# Altium schematic sheet BMS AFE - Top Sheet.SchDoc: Title
size B; Organization: Midnight Sun Solar Rayce Car Team; Address1: University of Waterloo; Address2: 200 University Ave W; Address3: Waterloo, ON, Canada; Address4: N2L 3E9; DocumentNumber: 1; SheetNumber: 1; SheetTotal: 7; Website: www.uwmidsun.com; ProjectName: ProjectName
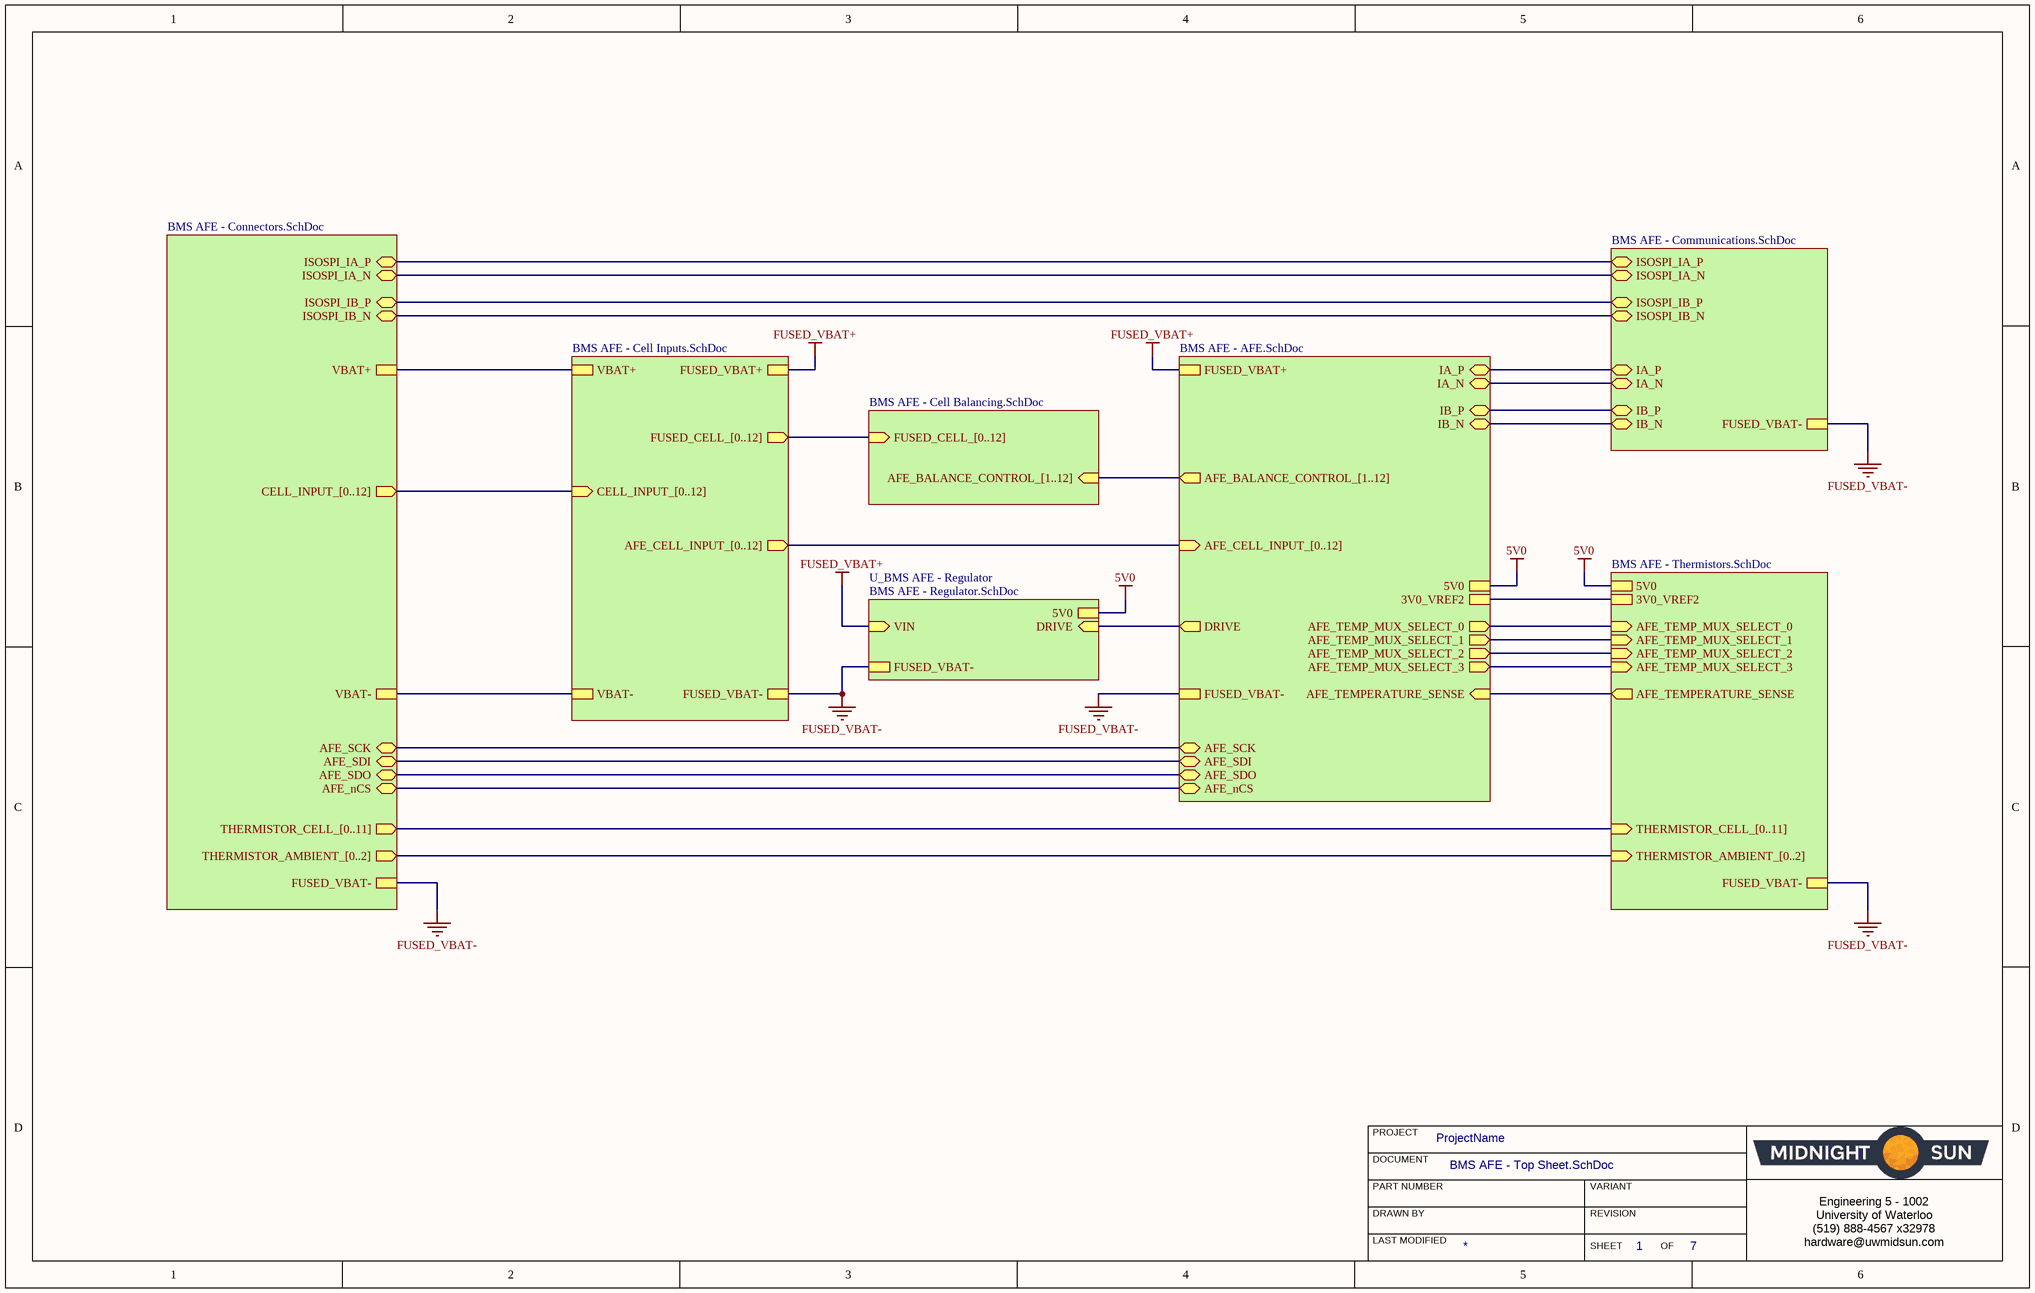
[diagram p0: BMS AFE - Top Sheet.SchDoc]

## Sub-sheets
BMS AFE - AFE = BMS AFE - AFE.SchDoc: AFE_BALANCE_CONTROL_[1..12] (out), AFE_TEMP_MUX_SELECT_0 (out), AFE_TEMP_MUX_SELECT_3 (out), AFE_nCS (bidir), AFE_SCK (bidir), AFE_TEMP_MUX_SELECT_2 (out), 5V0, FUSED_VBAT-, 3V0_VREF2, AFE_CELL_INPUT_[0..12] (in), AFE_TEMPERATURE_SENSE (in), AFE_TEMP_MUX_SELECT_1 (out), FUSED_VBAT+, AFE_SDI (bidir), AFE_SDO (bidir), IA_N (bidir), IA_P (bidir), IB_N (bidir), IB_P (bidir), DRIVE (out)
BMS AFE - Cell Balancing = BMS AFE - Cell Balancing.SchDoc: FUSED_CELL_[0..12] (in), AFE_BALANCE_CONTROL_[1..12] (in)
BMS AFE - Cell Inputs = BMS AFE - Cell Inputs.SchDoc: VBAT+, FUSED_VBAT+, CELL_INPUT_[0..12] (in), AFE_CELL_INPUT_[0..12] (out), FUSED_VBAT-, FUSED_CELL_[0..12] (out), VBAT-
BMS AFE - Communications = BMS AFE - Communications.SchDoc: IB_P (bidir), IB_N (bidir), ISOSPI_IA_P (bidir), ISOSPI_IA_N (bidir), IA_P (bidir), ISOSPI_IB_P (bidir), IA_N (bidir), ISOSPI_IB_N (bidir), FUSED_VBAT-
BMS AFE - Connectors = BMS AFE - Connectors.SchDoc: ISOSPI_IB_N (bidir), ISOSPI_IB_P (bidir), ISOSPI_IA_N (bidir), ISOSPI_IA_P (bidir), VBAT+, VBAT-, AFE_nCS (bidir), AFE_SCK (bidir), CELL_INPUT_[0..12] (out), THERMISTOR_CELL_[0..11] (out), AFE_SDI (bidir), AFE_SDO (bidir), FUSED_VBAT-, THERMISTOR_AMBIENT_[0..2] (out)
BMS AFE - Thermistors = BMS AFE - Thermistors.SchDoc: AFE_TEMPERATURE_SENSE (out), THERMISTOR_AMBIENT_[0..2] (in), 5V0, 3V0_VREF2, AFE_TEMP_MUX_SELECT_3 (in), AFE_TEMP_MUX_SELECT_2 (in), AFE_TEMP_MUX_SELECT_1 (in), AFE_TEMP_MUX_SELECT_0 (in), THERMISTOR_CELL_[0..11] (in), FUSED_VBAT-
U_BMS AFE - Regulator = BMS AFE - Regulator.SchDoc: DRIVE (in), VIN (in), 5V0, FUSED_VBAT-

## Nets
5V0: sheet BMS AFE - AFE/5V0, sheet BMS AFE - Thermistors/5V0, sheet U_BMS AFE - Regulator/5V0
FUSED_VBAT+: sheet BMS AFE - AFE/FUSED_VBAT+, sheet BMS AFE - Cell Inputs/FUSED_VBAT+, sheet U_BMS AFE - Regulator/VIN
FUSED_VBAT-: sheet BMS AFE - AFE/FUSED_VBAT-, sheet BMS AFE - Cell Inputs/FUSED_VBAT-, sheet BMS AFE - Communications/FUSED_VBAT-, sheet BMS AFE - Thermistors/FUSED_VBAT-, sheet BMS AFE - Connectors/FUSED_VBAT-, sheet U_BMS AFE - Regulator/FUSED_VBAT-
(unnamed): sheet BMS AFE - AFE/AFE_TEMP_MUX_SELECT_0, sheet BMS AFE - Thermistors/AFE_TEMP_MUX_SELECT_0
(unnamed): sheet BMS AFE - AFE/AFE_TEMP_MUX_SELECT_3, sheet BMS AFE - Thermistors/AFE_TEMP_MUX_SELECT_3
(unnamed): sheet BMS AFE - AFE/AFE_nCS, sheet BMS AFE - Connectors/AFE_nCS
(unnamed): sheet BMS AFE - AFE/AFE_SCK, sheet BMS AFE - Connectors/AFE_SCK
(unnamed): sheet BMS AFE - AFE/AFE_TEMP_MUX_SELECT_2, sheet BMS AFE - Thermistors/AFE_TEMP_MUX_SELECT_2
(unnamed): sheet BMS AFE - AFE/3V0_VREF2, sheet BMS AFE - Thermistors/3V0_VREF2
(unnamed): sheet BMS AFE - AFE/AFE_TEMPERATURE_SENSE, sheet BMS AFE - Thermistors/AFE_TEMPERATURE_SENSE
(unnamed): sheet BMS AFE - AFE/AFE_TEMP_MUX_SELECT_1, sheet BMS AFE - Thermistors/AFE_TEMP_MUX_SELECT_1
(unnamed): sheet BMS AFE - AFE/AFE_SDI, sheet BMS AFE - Connectors/AFE_SDI
(unnamed): sheet BMS AFE - AFE/AFE_SDO, sheet BMS AFE - Connectors/AFE_SDO
(unnamed): sheet BMS AFE - AFE/IA_N, sheet BMS AFE - Communications/IA_N
(unnamed): sheet BMS AFE - AFE/IA_P, sheet BMS AFE - Communications/IA_P
(unnamed): sheet BMS AFE - AFE/IB_N, sheet BMS AFE - Communications/IB_N
(unnamed): sheet BMS AFE - AFE/IB_P, sheet BMS AFE - Communications/IB_P
(unnamed): sheet BMS AFE - AFE/DRIVE, sheet U_BMS AFE - Regulator/DRIVE
(unnamed): sheet BMS AFE - Cell Inputs/VBAT+, sheet BMS AFE - Connectors/VBAT+
(unnamed): sheet BMS AFE - Cell Inputs/VBAT-, sheet BMS AFE - Connectors/VBAT-
(unnamed): sheet BMS AFE - Communications/ISOSPI_IA_P, sheet BMS AFE - Connectors/ISOSPI_IA_P
(unnamed): sheet BMS AFE - Communications/ISOSPI_IA_N, sheet BMS AFE - Connectors/ISOSPI_IA_N
(unnamed): sheet BMS AFE - Communications/ISOSPI_IB_P, sheet BMS AFE - Connectors/ISOSPI_IB_P
(unnamed): sheet BMS AFE - Communications/ISOSPI_IB_N, sheet BMS AFE - Connectors/ISOSPI_IB_N

## Buses and harness runs
bus sheet BMS AFE - AFE/AFE_BALANCE_CONTROL_[1..12] = sheet BMS AFE - Cell Balancing/AFE_BALANCE_CONTROL_[1..12]
bus sheet BMS AFE - AFE/AFE_CELL_INPUT_[0..12] = sheet BMS AFE - Cell Inputs/AFE_CELL_INPUT_[0..12]
bus sheet BMS AFE - Cell Balancing/FUSED_CELL_[0..12] = sheet BMS AFE - Cell Inputs/FUSED_CELL_[0..12]
bus sheet BMS AFE - Cell Inputs/CELL_INPUT_[0..12] = sheet BMS AFE - Connectors/CELL_INPUT_[0..12]
bus sheet BMS AFE - Connectors/THERMISTOR_AMBIENT_[0..2] = sheet BMS AFE - Thermistors/THERMISTOR_AMBIENT_[0..2]
bus sheet BMS AFE - Connectors/THERMISTOR_CELL_[0..11] = sheet BMS AFE - Thermistors/THERMISTOR_CELL_[0..11]

## Notes on the sheet
- PROJECT
- DOCUMENT
- DRAWN BY
- LAST MODIFIED
- PART NUMBER
- REVISION
- SHEET
- VARIANT
- OF
- Engineering 5 - 1002
  University of Waterloo
  (519) 888-4567 x32978
  hardware@uwmidsun.com